# Altium project Barrier_control.PrjPcb
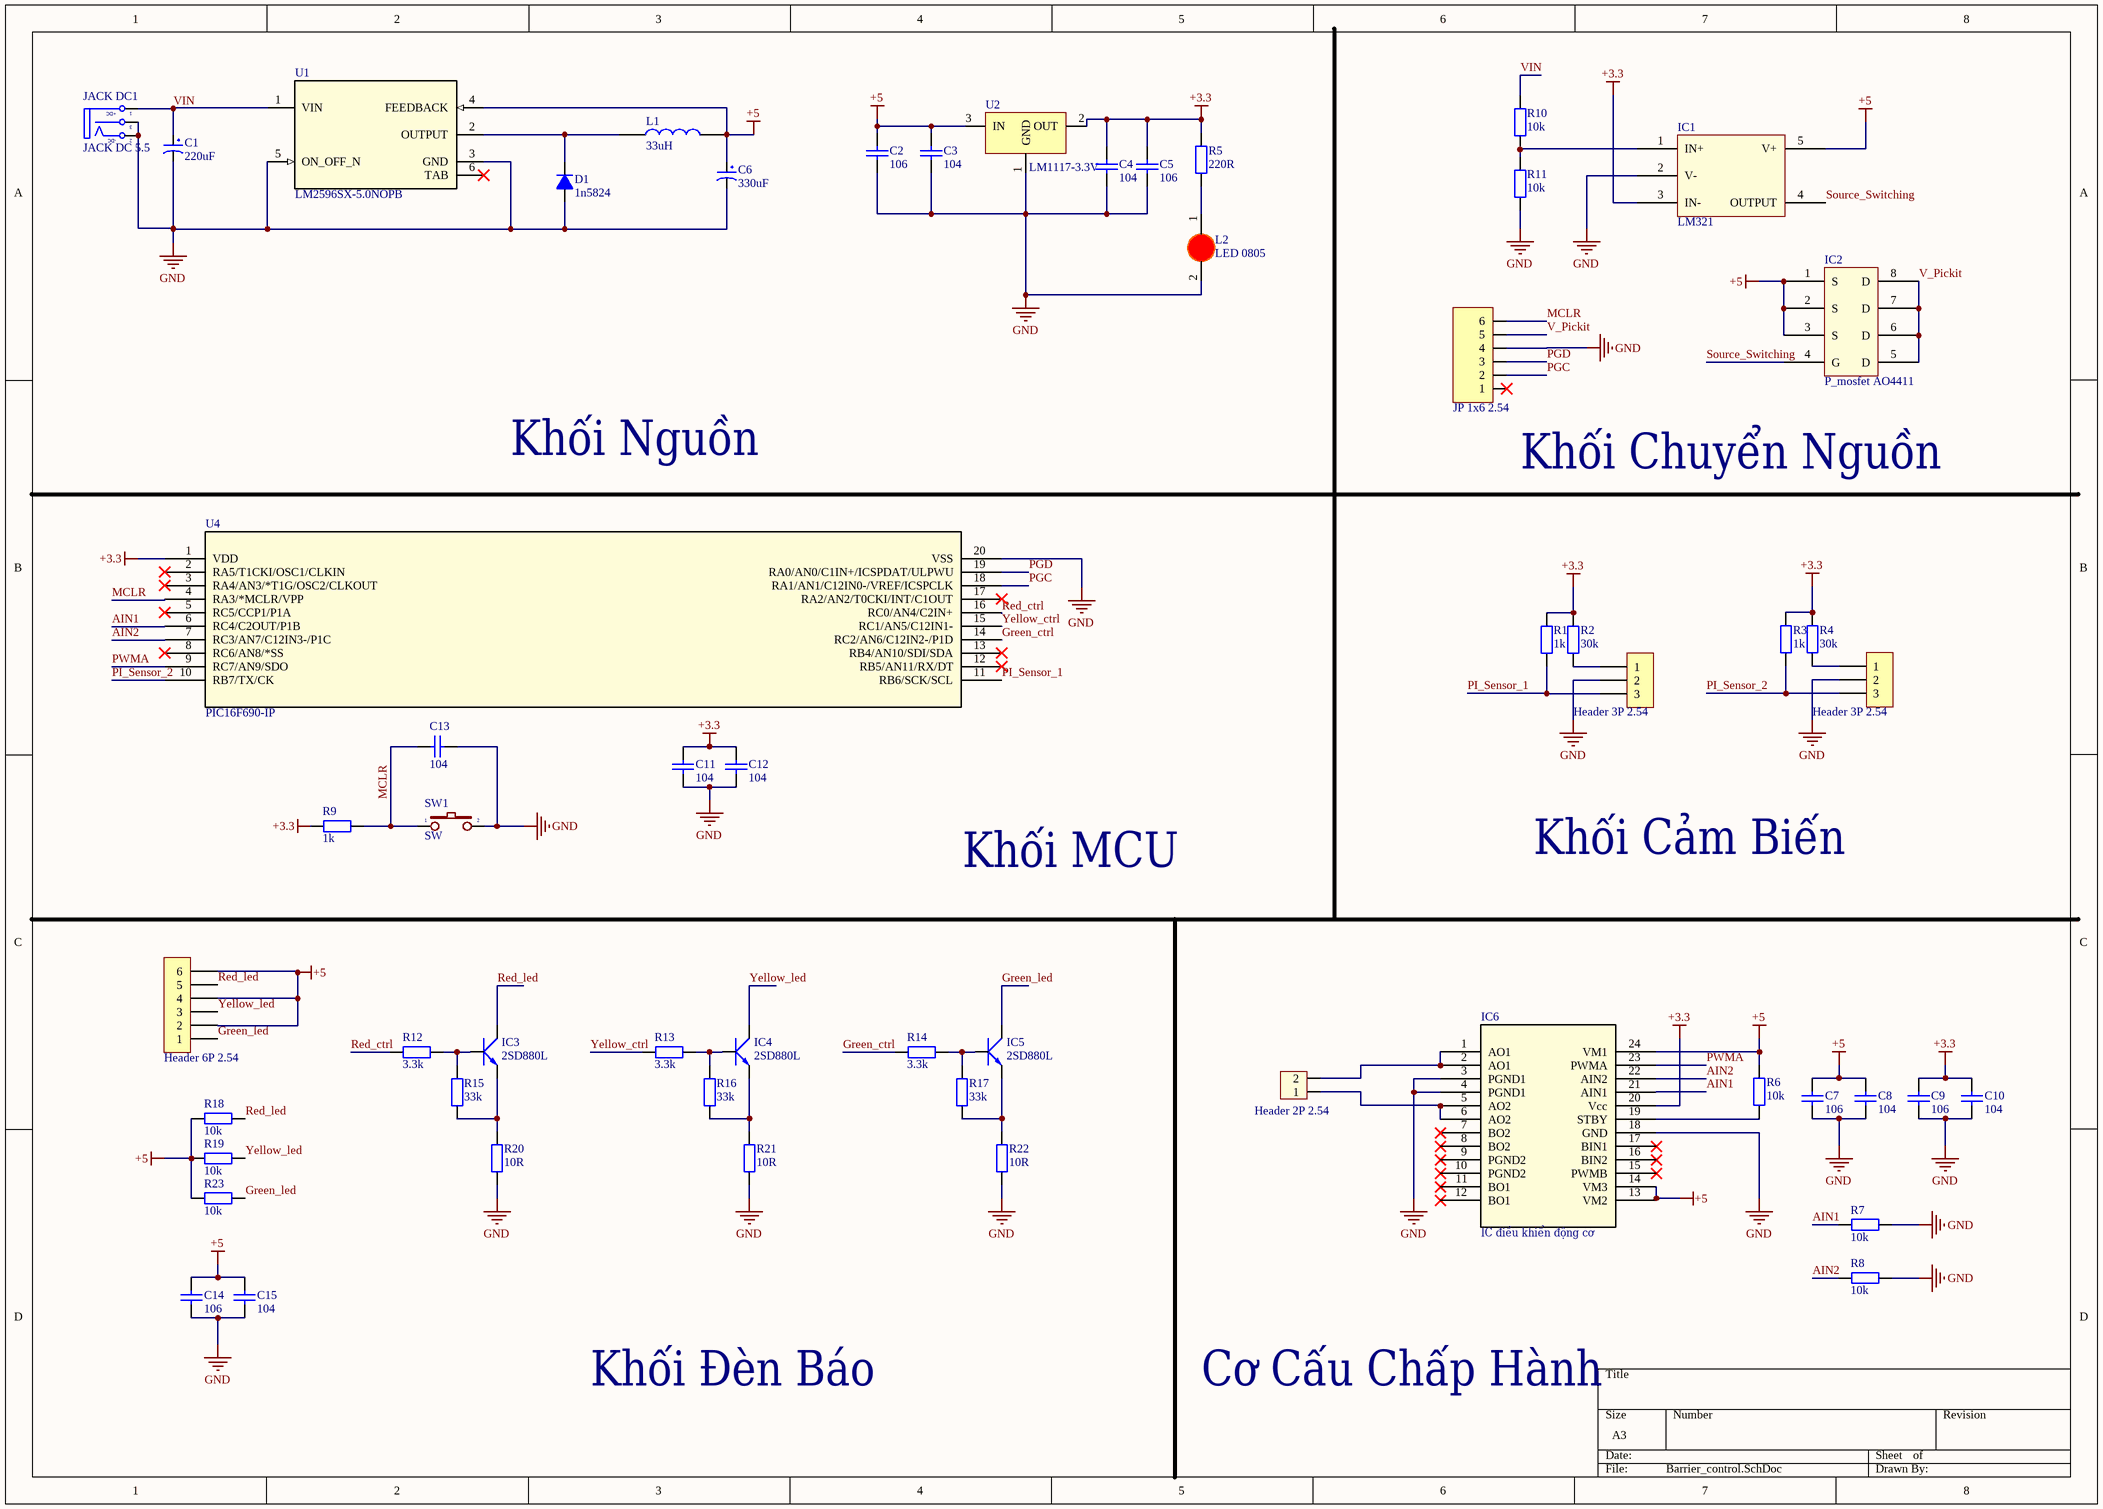
[diagram p0: Barrier_control.SchDoc]
1 sheet, 57 parts. Net scope: global (net labels, ports and power ports of the same name join across sheets).
Board file: Barrier_control.PcbDoc

## Sheet Barrier_control.SchDoc
size A3; SheetNumber: 1; SheetTotal: 1

### Parts
C1  220uF  [tu hoa 6.5mm]
C2  106  [tu 1206]
C3  104  [tu 1206]
C4  104  [tu 1206]
C5  106  [tu 1206]
C6  330uF  [tu hoa 10mm]
C7  106  [tu 1206]
C8  104  [tu 1206]
C9  106  [tu 1206]
C10  104  [tu 1206]
C11  104  [tu 0805]
C12  104  [tu 0805]
C13  104  [tu gom]
C14  106  [tu 1206]
C15  104  [tu 1206]
D1  1n5824  [DIODE 1A]
H1  Header 3P 2.54  [XH2.54M-3]
H2  Header 3P 2.54  [XH2.54M-3]
H3  Header 2P 2.54  [XH2.54M-2]
H4  Header 6P 2.54  [XH2.54M-6]
IC1  LM321  [SOT23_LM321]
IC2  P_mosfet AO4411  [SOIC8_AO4411]
IC3  2SD880L  [TO220]
IC4  2SD880L  [TO220]
IC5  2SD880L  [TO220]
IC6  IC điều khiển động cơ  [SSOP24-P-300-0p65A_TOS]
JACK_DC1  JACK DC 5.5  [JACK DC 5.5]
JP1  JP 1x6 2.54  [JP 1x6 DC]
L1  33uH  [Cuon Cam 12x12x10]
L2  LED 0805  [LED-0805-Red]
R1  1k  [tro smd 0805]
R2  30k  [tro smd 0805]
R3  1k  [tro smd 0805]
R4  30k  [tro smd 0805]
R5  220R  [tro smd 0805]
R6  10k  [tro smd 0805]
R7  10k  [tro smd 0805]
R8  10k  [tro smd 0805]
R9  1k  [tro smd 0805]
R10  10k  [tro smd 0805]
R11  10k  [tro smd 0805]
R12  3.3k  [tro smd 0805]
R13  3.3k  [tro smd 0805]
R14  3.3k  [tro smd 0805]
R15  33k  [tro smd 0805]
R16  33k  [tro smd 0805]
R17  33k  [tro smd 0805]
R18  10k  [tro smd 0805]
R19  10k  [tro smd 0805]
R20  10R  [tro smd 0805]
R21  10R  [tro smd 0805]
R22  10R  [tro smd 0805]
R23  10k  [tro smd 0805]
SW1  SW  [SW2]
U1  LM2596SX-5.0NOPB  [KTT0005B]
U2  LM1117-3.3V  [LM1117-SOP]
U4  PIC16F690-IP  [PDIP20_300MC_MCH]

### Nets
+3.3: C4.1 C5.2 C9.2 C10.1 C11.1 C12.1 IC1.3(IN-) IC6.20(Vcc) R1.2 R2.2 R3.2 R4.2 R5.1 R9.2 U2.2(OUT) U4.1(VDD)
+5: C2.2 C3.1 C6.1 C7.2 C8.1 C14.2 C15.1 H4.2 H4.4 H4.6 IC1.5(V+) IC2.1(S) IC2.2(S) IC2.3(S) IC6.13(VM2) IC6.14(VM3) IC6.24(VM1) L1.2 R6.2 R18.2 R19.2 R23.2 U1.4(FEEDBACK) U2.3(IN)
GND: C1.2 C2.1 C3.2 C4.2 C5.1 C6.2 C7.1 C8.2 C9.1 C10.2 C11.2 C12.2 C13.2 C14.1 C15.2 D1.1(A) H1.2 H2.2 IC1.2(V-) IC6.3(PGND1) IC6.4(PGND1) IC6.18(GND) JACK_DC1.2(TN) JACK_DC1.3(S) JP1.4 L2.2(K) R7.1 R8.1 R11.1 R20.1 R21.1 R22.1 SW1.2 U1.3(GND) U1.5(ON_OFF_N) U2.1(GND) U4.20(VSS)
AIN1: IC6.21(AIN1) R7.2 U4.6(RC4/C2OUT/P1B)
AIN2: IC6.22(AIN2) R8.2 U4.7(RC3/AN7/C12IN3-/P1C)
Green_ctrl: R14.1 U4.14(RC2/AN6/C12IN2-/P1D)
Green_led: H4.1 IC5.3(C) R23.1
MCLR: C13.1 JP1.6 R9.1 SW1.1 U4.4(RA3/*MCLR/VPP)
PGC: JP1.2 U4.18(RA1/AN1/C12IN0-/VREF/ICSPCLK)
PGD: JP1.3 U4.19(RA0/AN0/C1IN+/ICSPDAT/ULPWU)
PI_Sensor_1: H1.3 R1.1 U4.11(RB6/SCK/SCL)
PI_Sensor_2: H2.3 R3.1 U4.10(RB7/TX/CK)
PWMA: IC6.23(PWMA) U4.9(RC7/AN9/SDO)
Red_ctrl: R12.1 U4.16(RC0/AN4/C2IN+)
Red_led: H4.5 IC3.3(C) R18.1
Source_Switching: IC1.4(OUTPUT) IC2.4(G)
V_Pickit: IC2.5(D) IC2.6(D) IC2.7(D) IC2.8(D) JP1.5
VIN: C1.1 JACK_DC1.1(T) R10.2 U1.1(VIN)
Yellow_ctrl: R13.1 U4.15(RC1/AN5/C12IN1-)
Yellow_led: H4.3 IC4.3(C) R19.1
NetD1_2: D1.2(K) L1.1 U1.2(OUTPUT)
NetH1_1: H1.1 R2.1
NetH2_1: H2.1 R4.1
NetH3_1: H3.1 IC6.5(AO2) IC6.6(AO2)
NetH3_2: H3.2 IC6.1(AO1) IC6.2(AO1)
NetIC1_1: IC1.1(IN+) R10.1 R11.2
NetIC3_1: IC3.1(B) R12.2 R15.2
NetIC3_2: IC3.2(E) R15.1 R20.2
NetIC4_1: IC4.1(B) R13.2 R16.2
NetIC4_2: IC4.2(E) R16.1 R21.2
NetIC5_1: IC5.1(B) R14.2 R17.2
NetIC5_2: IC5.2(E) R17.1 R22.2
NetIC6_19: IC6.19(STBY) R6.1
NetL2_1: L2.1(A) R5.2

Not connected (* = marked no-connect by the designer): IC6 7(BO2)* 8(BO2)* 9(PGND2)* 10(PGND2)* 11(BO1)* 12(BO1)* 15(PWMB)* 16(BIN2)* 17(BIN1)*; JP1 1*; U1 6(TAB)*; U4 2(RA5/T1CKI/OSC1/CLKIN)* 3(RA4/AN3/*T1G/OSC2/CLKOUT)* 5(RC5/CCP1/P1A)* 8(RC6/AN8/*SS)* 12(RB5/AN11/RX/DT)* 13(RB4/AN10/SDI/SDA)* 17(RA2/AN2/T0CKI/INT/C1OUT)*

### Notes on the sheet
- Khối Nguồn
- Khối Chuyển Nguồn
- Khối MCU
- Khối Cảm Biến
- Khối Đèn Báo
- Cơ Cấu Chấp Hành
- (in symbol JACK DC 5.5) +DC; -DC

### Library data of the parts
C1 = Tu Hoa 220uF 16V 7x11: Cắm; Don_Vi: Con; Ten_Linh_Kien: Tụ Hóa 220uF 16V 7x11MM; So_Chan: 2; Ma_Hang: MH008416; Chung_Loai: Cắm; Kieu_Chan: *
C2 C5 C7 C9 C14 = Tu 1206 106 16V 20%: Dán; Don_Vi: Con; So_Chan: 2; Ten_Linh_Kien: Tụ 1206 106-10uF 20% 16V; Ma_Hang: MH004541; Chung_Loai: Dán; Kieu_Chan: *
C3 C4 C8 C10 C15 = Tu 1206 104 50V 20%: Dán; Don_Vi: Con; So_Chan: 2; Ten_Linh_Kien: Tụ 1206 104-0.1uF 20% 50V; Ma_Hang: MH004544; Chung_Loai: Dán; Kieu_Chan: *
C6 = Tu Hoa 330uF 35V 10x12: Cắm; So_Chan: 2; Don_Vi: Con; Ten_Linh_Kien: Tụ Hóa 330uF 35V 10x12MM; Ma_Hang: MH004802; Chung_Loai: Cắm; Kieu_Chan: *
C11 C12 = Tu 0805 104 50V 10%: Dán; Don_Vi: Con; So_Chan: 2; Ten_Linh_Kien: Tụ 0805 104-100nF 10% 50V; Ma_Hang: MH004551; Chung_Loai: Dán; Kieu_Chan: *
C13 = Tu gom 104 50V: Cắm; So_Chan: 2; Ten_Linh_Kien: Tụ gốm 104 100nF 50V; Don_Vi: Con; Ma_Hang: MH004761; Chung_Loai: Cắm; Kieu_Chan: *
D1 = Diode 1N4007: Cắm; Ten_Linh_Kien: Diode 1N4007 1A (DIP); Don_Vi: Con; Ma_Hang: MH001063; Ghi Chu: *; Kieu_Chan: *; Chung_Loai: Cắm
H1 H2 = Header 3P 2.54 Duc Thang: Cắm; Ten_Linh_Kien: Header 3P XH2.54-3P Đực Thẳng; Don_Vi: Con; Ma_Hang: MH001292; Chung_Loai: Cắm
H3 = Header 2P 2.54 Duc Thang: Cắm; Ten_Linh_Kien: Header 2P XH2.54-2P Đực Thẳng; Don_Vi: Con; Ma_Hang: MH001283; Chung_Loai: Cắm
H4 = Header 6P 2.54 Duc Thang: Cắm; Ten_Linh_Kien: Header 6P XH2.54-6P Đực Thẳng; Don_Vi: Con; Ma_Hang: MH001972; Chung_Loai: Cắm
IC3-IC5 = transistor NPN
IC6 = TB6612FNG
JACK_DC1 = JACK DC 5.5: Value: Jac DC
JP1 = JP 1x6 2.54 Duc Cong: Cắm; Ten_Linh_Kien: Jump Đơn Đực 2.54MM 1x40P Cong Đứng; Don_Vi: Con; Ma_Hang: MH000904; Ghi_Chu: *; Kieu_Chan: *; Chung_Loai: Cắm
L1 = CUON CAM 100uH SMD: Dán; Don_Vi: Con; Ma_Hang: MH003999; Ten_Linh_Kien: Cuộn Cảm 100uH 7x7x4MM CD74; Ma_Hang: *; Kieu_Chan: *; Chung_Loai: Dán
L2 = LED 0805 Do: Dán; Don_Vi: Con; Ma_Hang: MH000897; Ten_Linh_Kien: LED 0805 Màu Đỏ (Red); Ghi_Chu: *; Kieu_Chan: *; Chung_Loai: Dán
R1 R3 R9 = Tro 0805 1% 1k: Dán; Don_Vi: Con; So_Chan: 2; Ten_Linh_Kien: Trở 0805 1% 1k; Ma_Hang: MH005468; Chung_Loai: Dán; Kieu_Chan: *
R2 R4 R15-R17 = Tro 0805 1% 33k: Dán; Don_Vi: Con; So_Chan: 2; Ten_Linh_Kien: Trở 0805 1% 33k; Ma_Hang: MH005478; Chung_Loai: Dán; Kieu_Chan: *
R5 = Tro 0805 1% 0.5R: Dán; Don_Vi: Con; So_Chan: 2; Ten_Linh_Kien: Trở 0805 1% 0.5R; Ma_Hang: MH005465; Chung_Loai: Dán; Kieu_Chan: *
R6-R8 R10 R11 R18 R19 R23 = Tro 0805 1% 10k: Dán; Don_Vi: Con; So_Chan: 2; Ten_Linh_Kien: Trở 0805 1% 10k; Ma_Hang: MH005473; Chung_Loai: Dán; Kieu_Chan: *
R12-R14 = Tro 0805 1% 3.3k: Dán; Don_Vi: Con; So_Chan: 2; Ten_Linh_Kien: Trở 0805 1% 3.3k; Ma_Hang: MH005472; Chung_Loai: Dán; Kieu_Chan: *
R20-R22 = Tro 0805 1% 10R: Dán; Don_Vi: Con; So_Chan: 2; Ten_Linh_Kien: Trở 0805 1% 10R; Ma_Hang: MH005474; Chung_Loai: Dán; Kieu_Chan: *
SW1 = SW2: Switch button 2 pin; Value: SW chip 2 pin
U1 = LM2596SX-5.0NOPB: No Description Available; Mfr_Name: Texas Instruments; PartNumber: LM2596SX-ADJ/NOPB; Alternate_PartNumber: LM2596S-ADJ/NOPB; CompType: IC; TYPE: TYPE; RefDes: RefDes; PackageReference: KTT0005B; MountType: SMT; RoHS: Y; Manufacturer: Texas Instruments
U2 = LM1117: 800mA Low-Dropout Linear Regulator; Creator: Nguyen Ba Bien; Website: http://group3i.net
U4 = PIC16F690-IP: No Description Available; Mfr_Name: Microchip; RefDes: RefDes; Type: Type